# EAGLE design mainboard (EAGLE 7.6.0)

## Sheet 1 of 2
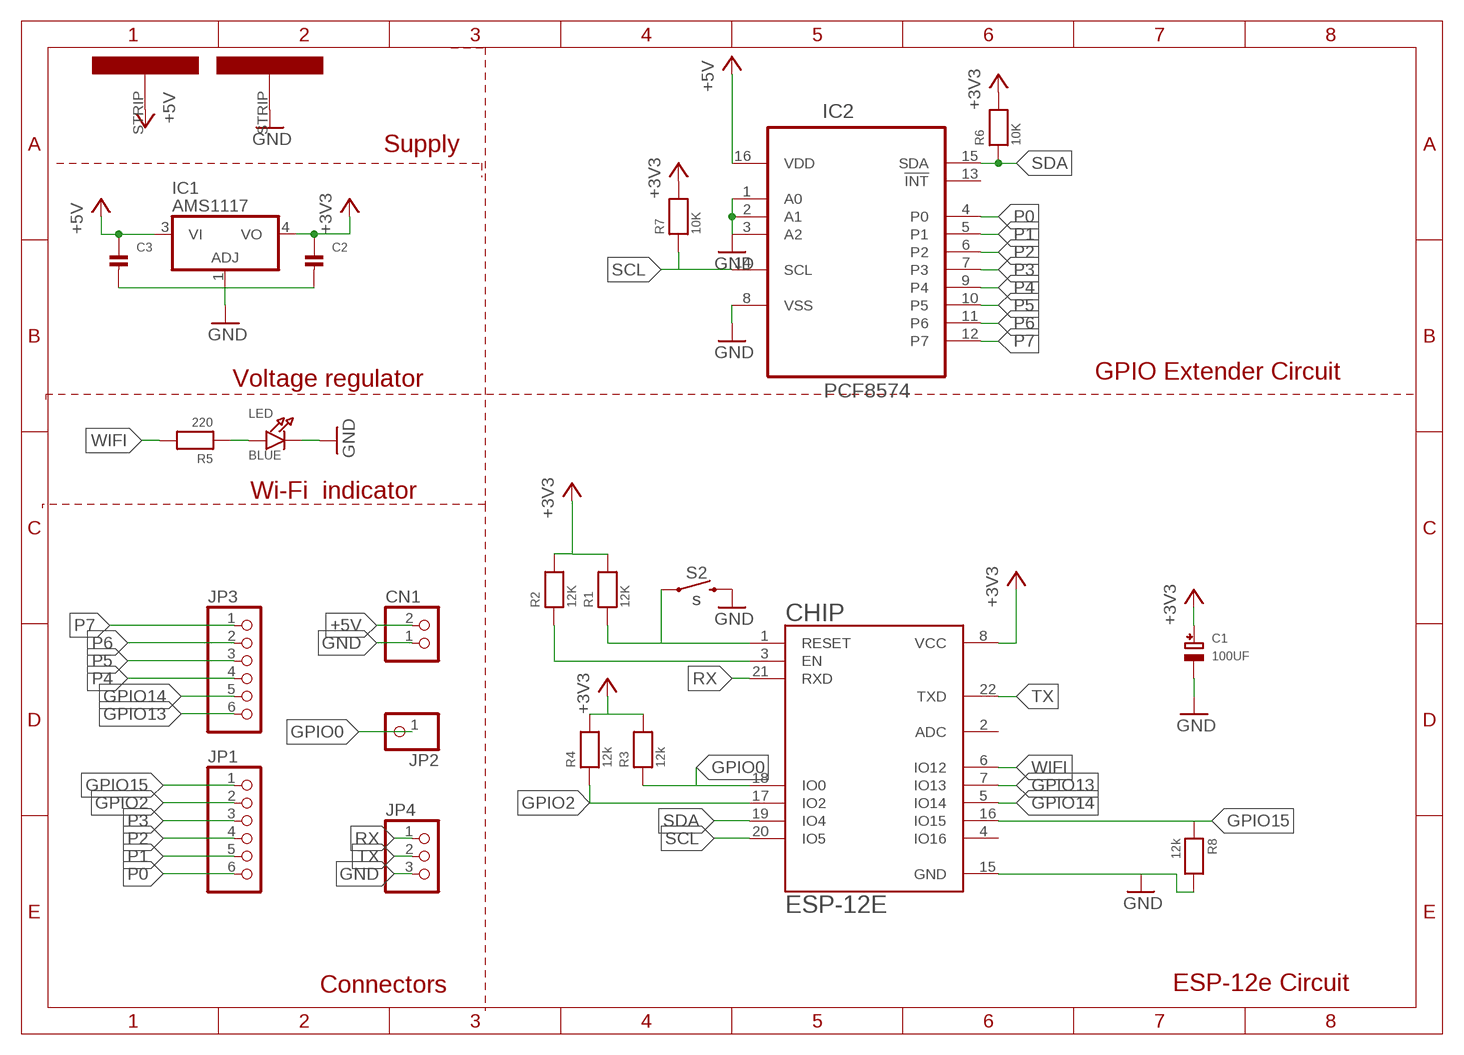
[diagram p0: schematic, sheet 1]

### Parts
C1  100UF  CAP_TANTALUMC/6032_WAVE  [EIA6032-28/C-W]
C2  CAP_CERAMIC0805  [0805]
C3  CAP_CERAMIC0805  [0805]
CHIP  ESP-12E  ESP8266-12E/ESP-12E  [XCVR_ESP8266-12E/ESP-12E]
CN1  JST_2PIN-THM  [JST-PH-2-THM]
IC1  AMS1117  317EMP  [SOT223]
IC2  PCF8574  PCF8574AT/3,518  [SOIC127P1032X265-16N]
JP1  PINHD-1X6CB  [1X06-CLEANBIG]
JP2  PINHD-1X1CB  [1X01-CLEANBIG]
JP3  PINHD-1X6CB  [1X06-CLEANBIG]
JP4  PINHD-1X3CB  [1X03-CLEANBIG]
LED  BLUE  LED0805  [CHIPLED_0805]
R1  12K  RESISTOR0805  [0805]
R2  12K  RESISTOR0805  [0805]
R3  12k  RESISTOR0805  [0805]
R4  12k  RESISTOR0805  [0805]
R5  220  RESISTOR0805  [0805]
R6  10K  RESISTOR0805  [0805]
R7  10K  RESISTOR0805  [0805]
R8  12k  RESISTOR0805  [0805]
RAIL1  RAIL1  STRIP  [STRIP]
RAIL2  RAIL2  STRIP  [STRIP]
S2  s  MOMENTARY-SWITCH-SPST-PTH-6.0MM-KIT  [TACTILE_SWITCH_PTH_6.0MM_KIT]

### Nets
+3V3: C1.+ C2.1 CHIP.8(VCC) IC1.4(VO) R1.2 R2.2 R3.2 R4.2 R6.2 R7.2
+5V: C3.1 CN1.2 IC1.3(VI) IC2.16(VDD) RAIL1.STRIP
GND: C1.- C2.2 C3.2 CHIP.15(GND) CN1.1 IC1.1(ADJ) IC2.1(A0) IC2.2(A1) IC2.3(A2) IC2.8(VSS) JP4.3 LED.C R8.2 RAIL2.STRIP S2.3
GPIO0: CHIP.18(IO0) JP2.1 R3.1
GPIO2: CHIP.17(IO2) JP1.2 R4.1
GPIO13: CHIP.7(IO13) JP3.6
GPIO14: CHIP.5(IO14) JP3.5
GPIO15: CHIP.16(IO15) JP1.1 R8.1
N$3: CHIP.1(RESET) R1.1 S2.1
N$4: CHIP.3(EN) R2.1
N$5: LED.A R5.1
P0: IC2.4(P0) JP1.6
P1: IC2.5(P1) JP1.5
P2: IC2.6(P2) JP1.4
P3: IC2.7(P3) JP1.3
P4: IC2.9(P4) JP3.4
P5: IC2.10(P5) JP3.3
P6: IC2.11(P6) JP3.2
P7: IC2.12(P7) JP3.1
RX: CHIP.21(RXD) JP4.1
SCL: CHIP.20(IO5) IC2.14(SCL) R7.1
SDA: CHIP.19(IO4) IC2.15(SDA) R6.1
TX: CHIP.22(TXD) JP4.2
WIFI: CHIP.6(IO12) R5.2
Unconnected: CHIP.2(ADC) CHIP.4(IO16) IC2.13(!INT)

### Notes on the sheet
- Supply
- Voltage regulator | GPIO Extender Circuit
- Wi-Fi  indicator
- Connectors | ESP-12e Circuit

## Sheet 2 of 2
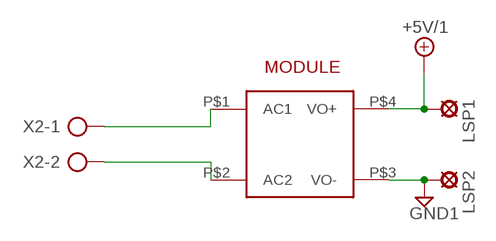
[diagram p1: schematic, sheet 2]

### Parts
LSP1  LSP10  [LSP10]
LSP2  LSP10  [LSP10]
MODULE  HLK-PM01  [HLK-PM01]
X2  AK500/2-H  [AK500/2-H]

### Nets
+5V/1: LSP1.MP MODULE.P$4(VO+)
GND1: LSP2.MP MODULE.P$3(VO-)
N$6: MODULE.P$1(AC1) X2.1
N$7: MODULE.P$2(AC2) X2.2

## Library data of the parts
C1 = microbuilder:CAP_TANTALUM: Tantalum Capacitors Wave footprints have larger pads and are meant to be used for hand soldering. Reflow footprints are optimised for solder paste and a reflow oven. EIA3216-18/A-[R/W] - Size A / 3216-18 / 1206 footprint 4.7µF 25V 10% Tantalum Capacitor 10µF 16V 10% Tantalum Capacitor [Digikey: 495-2236-2-ND] EIA3528-21/B-[R/W] - Size B / 3528-21 47µF 10V 10% Tantalum Capactior [Digikey: 495-2216-1-ND] EIA6032-28/C-[R/W] - Size C / 6032-28 10µF 35V 20% Tantalum Capacitor [Digikey: 495-2285-1-ND] 100µF 16V 10% Tantalum Capactior [Digikey: 399-5214-1-ND]
C2 C3 = microbuilder:CAP_CERAMIC: Ceramic Capacitors 0402 - 0402 Surface Mount Capacitors 16pF 50V 5% [Digikey: 445-4899-2-ND] 18pF 50V 5% [Digikey: 490-1281-2-ND] 22pF 50V 5% [Digikey: 490-1283-2-ND] 68pF 50V 5% [Digikey: 490-1289-2-ND] 0.1uF 10V 10% [Digikey: 490-1318-2-ND] 1.0uF 6.3V 10% [Digikey: 490-1320-2-ND] 0603 - 0603 Surface Mount Capacitors 16 pF 50V 5% [Digikey: 445-5051-2-ND] 22 pF 50V [Digikey: PCC220ACVTR-ND] 33 pF 50V 5% [Digikey: 490-1415-1-ND] 56pF 50V 5% [Digikey: 490-1421-1-ND] 220pF 50V 5% [Digikey: 445-1285-1-ND] 680 pF 50V 2200 pF 50V 5% C0G [Digikey: 445-1297-1-ND] 5600 pF 100V 5% X7R [Digikey: 478-3711-1-ND] 0.1 µF 25V 10% [Digikey: PCC2277TR-ND] 0.22 µF 16V 10% X7R [Digikey: 445-1318-1-ND] 1.0 µF 25V 10% [Digikey: 445-5146-2-ND] 0603 - RF Specific 3pF 250V +/-0.1pF RF [Digikey: 712-1347-1-ND] 18 pF 250V 5% [Digikey: 478-3505-1-ND or 712-1322-1-ND] 56 pF 250V 5% C0G RF [Digikey: 490-4867-1-ND] 68 pF 250V RF [Digikey: 490-4868-1-ND] 0805 - 0805 Surface Mount Capacitors 220 pF 250V 2% RF Ceramic Capacitor [Digikey: 712-1398-1-ND] 1000 pF 50V 2% NP0 Ceramic Capacitor [Digikey: 478-3760-1-ND] 0.1 µF 25V 10% Ceramic Capacitor [Digikey: PCC1828TR-ND] 1.0 µF 16V 10% Ceramic Capacitor[Digikey: 490-1691-2-ND] 10.0 µF 10V 10% Ceramic Capacitor[Digikey: 709-1228-1-ND] 10.0 uF 16V 10% Ceramic Capacitor [Digikey: 478-5165-2-ND] 47 uF 6.3V 20% Ceramic Capacitor [Digikey: 587-1779-1-ND or 399-5506-1-ND] 1206 - 1206 Surface Mount Capacitors 47uF 10V 20% Ceramic Capacitor [Digikey: 490-5528-1-ND or 399-5508-1-ND or 445-6010-1-ND] 100uF 6.3V -20%, +80% Y5V Ceramic Capacitor (Digikey: 490-4512-1-ND, Mouser: 81-GRM31CF50J107ZE1L)
CHIP = ESP8266-12E_ESP-12E:ESP8266-12E/ESP-12E: ESP-12E WiFi Module; AVAILABILITY: Unavailable; DESCRIPTION: This WiFi module has a 32-bit MCU micro and clock speeds supporting 80 MHz or 160 MHz. Supports the RTOS and integrated Wi-Fi MAC/BB/RF/PA/LNA, and has an on-board antenna.; MF: AI-Thinker; MP: ESP8266-12E/ESP-12E; PACKAGE: None; PRICE: None
CN1 = adafruit:JST_2PIN: JST 2-Pin Connectors of various flavors SMT-RA (S2B-PH-SM4) 4UConnector #17311 SMT (B2B-PH-SM4) THM-RA (S2B-PH) THM (B2B-PH)
IC1 = linear:*317: Positive VOLTAGE REGULATOR
IC2 = PCF8574AT_3_518:PCF8574AT/3,518: IC, I/O EXPANDER, 8BIT, 16SOIC; DESCRIPTION: PCF8574 Series 2.5 - 6 V Remote 8-bit I/O Expander for I2C-bus - SOIC-16; DIGI-KEY_PART_NUMBER: 568-1074-1-ND; DIGI-KEY_PURCHASE_URL: https://www.digikey.com/product-detail/en/nxp-usa-inc/PCF8574AT-3,518/568-1074-1-ND/735790?utm_source=snapeda&utm_medium=aggregator&utm_campaign=symbol; MF: NXP USA; MP: PCF8574AT/3,518; PACKAGE: SOIC-16 NXP Semiconductors
JP1 JP3 = adafruit:PINHD-1X6: PIN HEADER
JP2 = adafruit:PINHD-1X1: Pin header 1x1 for 0.1" spacing With round pins
JP4 = adafruit:PINHD-1X3: PIN HEADER
LED = microbuilder:LED: LED 0603 - 0603 Surface Mount Package 2mA: Green LED - Low Power (3.9mcd, 2ma, 1.7Vf) - Digikey: 475-2709-2-ND Orange LED - Low Power (9.8mcd, 2ma, 1.8Vf) - Digikey: 475-1194-2-ND Red LED - Low Power (5mcd, 2ma, 1.8Vf) - Digikey: 475-1195-2-ND Yellow LED - Low Power (7mcd, 2ma, 1.8Vf) - Digikey: 475-1196-2-ND 5mA: Blue LED - Low Power (17mcd, 5ma, 2.9Vf) - Digikey: LNJ937W8CRACT-ND 0805 - 0805 Surface Mount Package 2mA: Red LED (8.8mcd, 2mA, 1.8Vf, Clear) - Low Power [Digikey: 475-2510-1-ND] Green LED (5mcd, 2mA, 1.8Vf, Clear) - Low Power [Digikey: 475-2730-1-ND] Yellow LED (11.3mcd, 2mA, 1.8Vf, Clear) - Low Power [Digikey: 475-2555-1-ND] 20mA: Red LED (104mcd, 20mA, Diffused) - LS R976 [Digikey: 475-1278-6-ND] Red LED (12mcd, 20mA, 2.0Vf, Clear) - APT2012EC [Digikey: 754-1128-1-ND] Green LED (15mcd, 20mA, 2.2Vf, Clear) - APT2012GC [Digikey: 754-1131-1-ND] Orange LED (160mcd, 20mA, 2.1Vf, Clear) - APT2012SECK [Digikey: 754-1130-1-ND] 1206 - 1206 Surface Mount Package Green LED (26mcd, 20mA, Diffused) - LG N971 [Digikey: 475-1407-6-ND] Red LED (15mcd, 20mA, Diffused) - LH N974 [Digikey: 475-1416-6-ND]
LSP1 LSP2 = solpad:LSP10: SOLDER PAD drill 1.0 mm, distributor Buerklin, 12H555
MODULE = HLK-PM01:HLK-PM01: HI-LINK Ultra-compact power module HLK-PM01 Meet UL, CE requirements Ultra-thin, ultra-small All voltage input (AC: 90 ~ 264V) Low ripple and low noise Output overload and short circuit protection High efficiency, high power density The product is designed to meet the requirements of EMC and Safety Test Low power consumption, environmental protection, no-load loss <0.1W 100% load aging and testing; AVAILABILITY: Unavailable; MF: Hi-link; MP: hlk-pm01; PACKAGE: Package Analog Devices; PRICE: None
R1-R8 = microbuilder:RESISTOR: Resistors 0402 - 0402 Surface Mount Package 22 Ohm 1% 1/16W [Digikey: 311-22.0LRTR-ND] 33 Ohm 5% 1/16W 1.0K 5% 1/16W 1.5K 5% 1/16W 2.0K 1% 1/16W 10.0K 1% 1/16W [Digikey: 311-10.0KLRTR-ND] 10.0K 5% 1/16W [Digikey: RMCF0402JT10K0TR-ND] 12.1K 1% 1/16W [Digikey: 311-22.0LRTR-ND] 100.0K 5% 1/16W 0603 - 0603 Surface Mount Package 0 Ohm 1/10 Watt 1% Resistor 15 Ohm 1/10 Watt 1% Resistor 33 Ohm 1/10 Watt 1% Resistor 49.9 Ohm 1/10 Watt 1% Resistor 100 Ohm 1/10 Watt 1% Resistor 150 Ohm 1/10 Watt 1% Resistor 240 Ohm 1/10 Watt 1% Resistor 390 Ohm 1/10 Watt 1% Resistor 560 Ohm 1/10 Watt 1% Resistor 680 Ohm 1/10 Watt 1% Resistor 750 Ohm 1/10 Watt 1% Resistor 1.0K Ohm 1/10 Watt 1% Resistor 1.5K Ohm 1/10 Watt 1% Resistor 2.0K Ohm 1/10 Watt 1% Resistor 2.2K Ohm 1/10 Watt 1% Resistor 3.3K Ohm 1/10 Watt 1% Resistor 4.7K Ohm 1/10 Watt 1% Resistor 10.0K Ohm 1/10 Watt 1% Resistor 12.0K Ohm 1/10 Watt 1% Resistor 12.1K Ohm 1/10 Watt 1% Resistor 20.0K Ohm 1/10 Watt 1% Resistor 33.0K Ohm 1/10 Watt 1% Resistor 100.0K Ohm 1/10 Watt 1% Resistor 0805 - 0805 Surface Mount Package 0 Ohm 1/8 Watt 1% Resistor 33 Ohm 1/8 Watt 1% Resistor 100 Ohm 1/8 Watt 1% Resistor 150 Ohm 1/8 Watt 1% Resistor 200 Ohm 1/8 Watt 1% Resistor 240 Ohm 1/8 Watt 1% Resistor 330 Ohm 1/8 Watt 1% Resistor 390 Ohm 1/8 Watt 1% Resistor 470 Ohm 1/8 Watt 1% Resistor 1.0K Ohm 1/8 Watt 1% Resistor 1.5K Ohm 1/8 Watt 1% Resistor 2.0K Ohm 1/8 Watt 1% Resistor 4.7K Ohm 1/8 Watt 1% Resistor 5.1K Ohm 1/8 Watt 1% Resistor 5.6K Ohm 1/8 Watt 1% Resistor 10.0K Ohm 1/8 Watt 1% Resistor 22.0K Ohm 1/8 Watt 1% Resistor 33.0K Ohm 1/8 Watt 1% Resistor 100K Ohm 1/8 Watt 1% Resistor 1206 - 1206 Surface Mount Package 2012 - 2010 Surface Mount Package 0.11 Ohm 1/2 Watt 1% Resistor - Digikey: RHM.11UCT-ND
RAIL1 RAIL2 = Alfred:STRIP
S2 = SparkFun-Switches:MOMENTARY-SWITCH-SPST: Momentary Switch (Pushbutton) - SPST Normally-open (NO) SPST momentary switches (buttons, pushbuttons). Variants PTH-12MM - 12mm square, through-hole Momentary Pushbutton Switch - 12mm Square <https://www.sparkfun.com/products/9190> (COM-09190) PTH-6.0MM, PTH-6.0MM-KIT - 6.0mm square, through-hole Mini Pushbutton Switch <https://www.sparkfun.com/products/97> (COM-00097) KIT package intended for soldering kit's - only one side of pads' copper is exposed. PTH-RIGHT-ANGLE-KIT - Right-angle, through-hole Right Angle Tactile Button <https://www.sparkfun.com/products/10791> - Used on SparkFun BigTime Watch Kit <https://www.sparkfun.com/products/11734> SMD-12MM - 12mm square, surface-mount Tactile Button - SMD (12mm) <https://www.sparkfun.com/products/12993> (COM-12993) Used on SparkFun PicoBoard <https://www.sparkfun.com/products/11888> SMD-4.5MM - 4.5mm Square Trackball Switch Used on SparkFun Blackberry Trackballer Breakout <https://www.sparkfun.com/products/13169> SMD-4.6MMX2.8MM - 4.60mm x 2.80mm, surface mount Used on SparkFun SAMD21 Mini Breakout <https://www.sparkfun.com/products/13664> SMD-5.2MM, SMD-5.2-REDUNDANT - 5.2mm square, surface-mount Mini Pushbutton Switch - SMD <https://www.sparkfun.com/products/8720> (COM-08720) Used on Arduino Pro Mini <https://www.sparkfun.com/products/11114> REDUNDANT package connects both switch circuits together SMD-6.0X3.5MM - 6.0 x 3.5mm, surface mount Momentary Reset Switch SMD <https://www.sparkfun.com/products/8229> (COM-08229) SMD-6.2MM-TALL - 6.2mm square, surface mount Tactile Button - SMD (6mm) <https://www.sparkfun.com/products/12992> Used on SparkFun Digital Sandbox <https://www.sparkfun.com/products/12651> SMD-RIGHT-ANGLE - Right-angle, surface mount Used on SparkFun Block for Intel® Edison - Arduino <https://www.sparkfun.com/products/13036>; PROD_ID: SWCH-08441; SF_SKU: COM-00097
X2 = con-ptr500:AK500/2-H: CONNECTOR Aug. 2004 / PTR Meßtechnik: Die Bezeichnung der Serie AK505 wurde geändert. Es handelt sich hierbei um AK500 in horizontaler Ausführung.; OC_FARNELL: unknown; OC_NEWARK: unknown

## Net classes
0 default: width 0.4 mm, drill 0.5 mm, clearance 0.305 mm

## Board
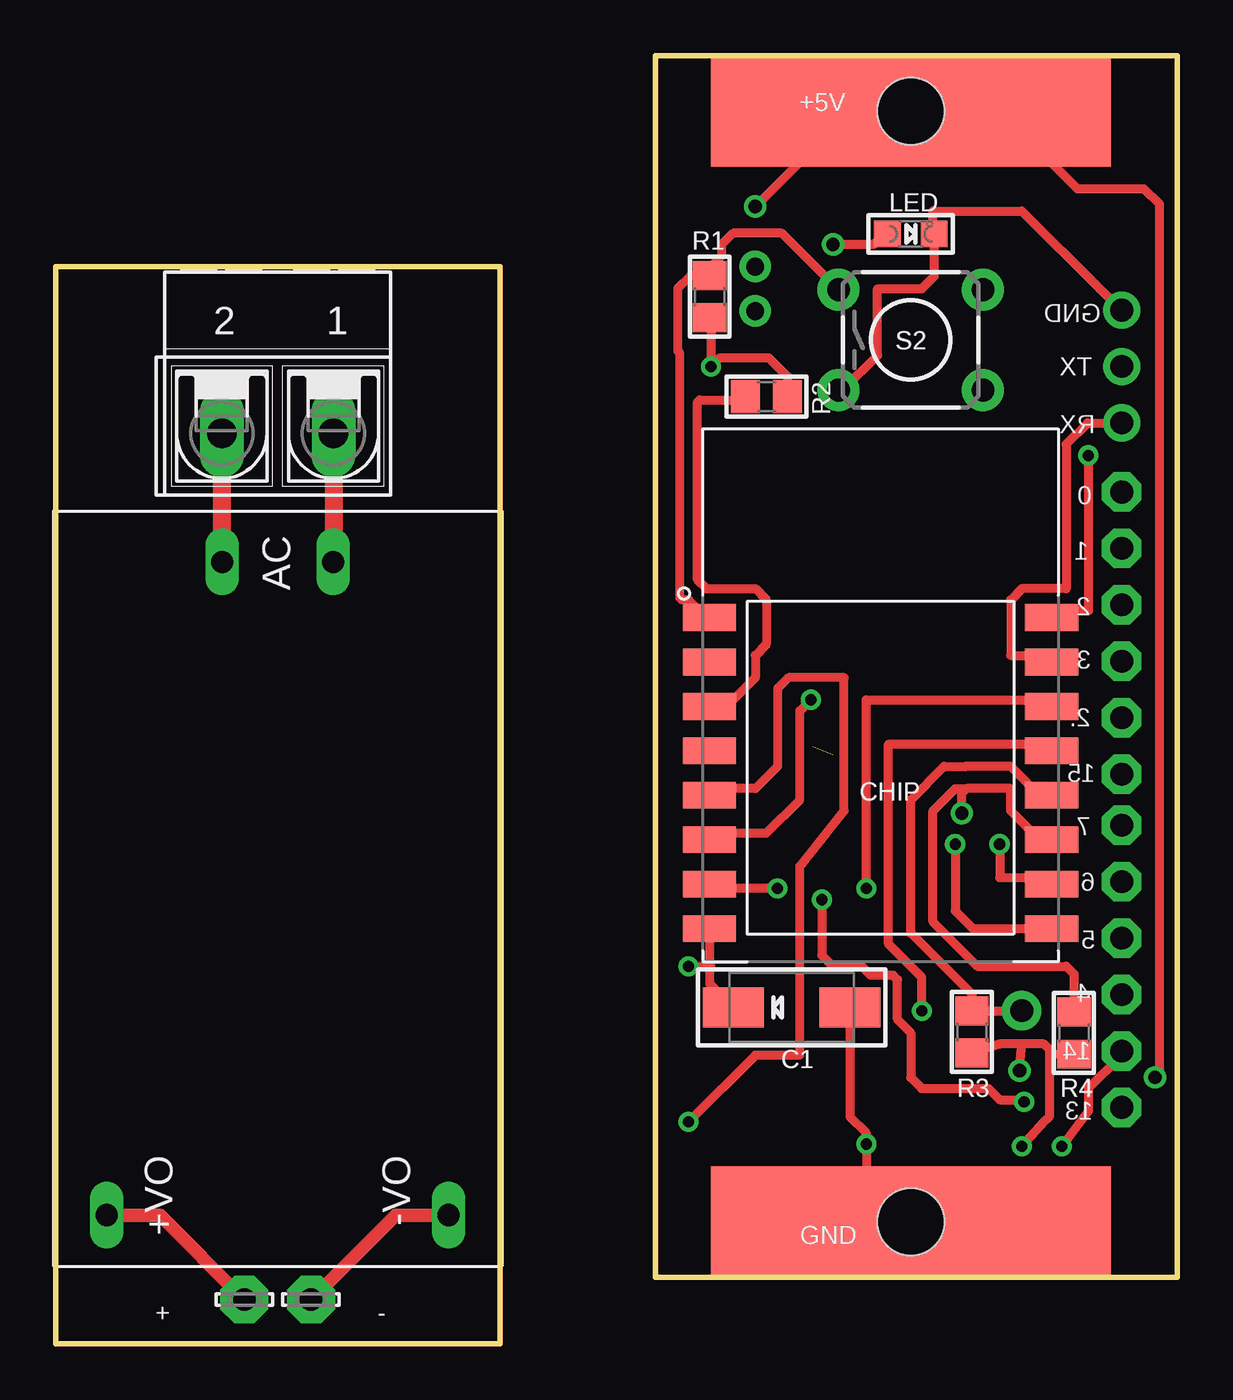
[diagram p2: board, top side]
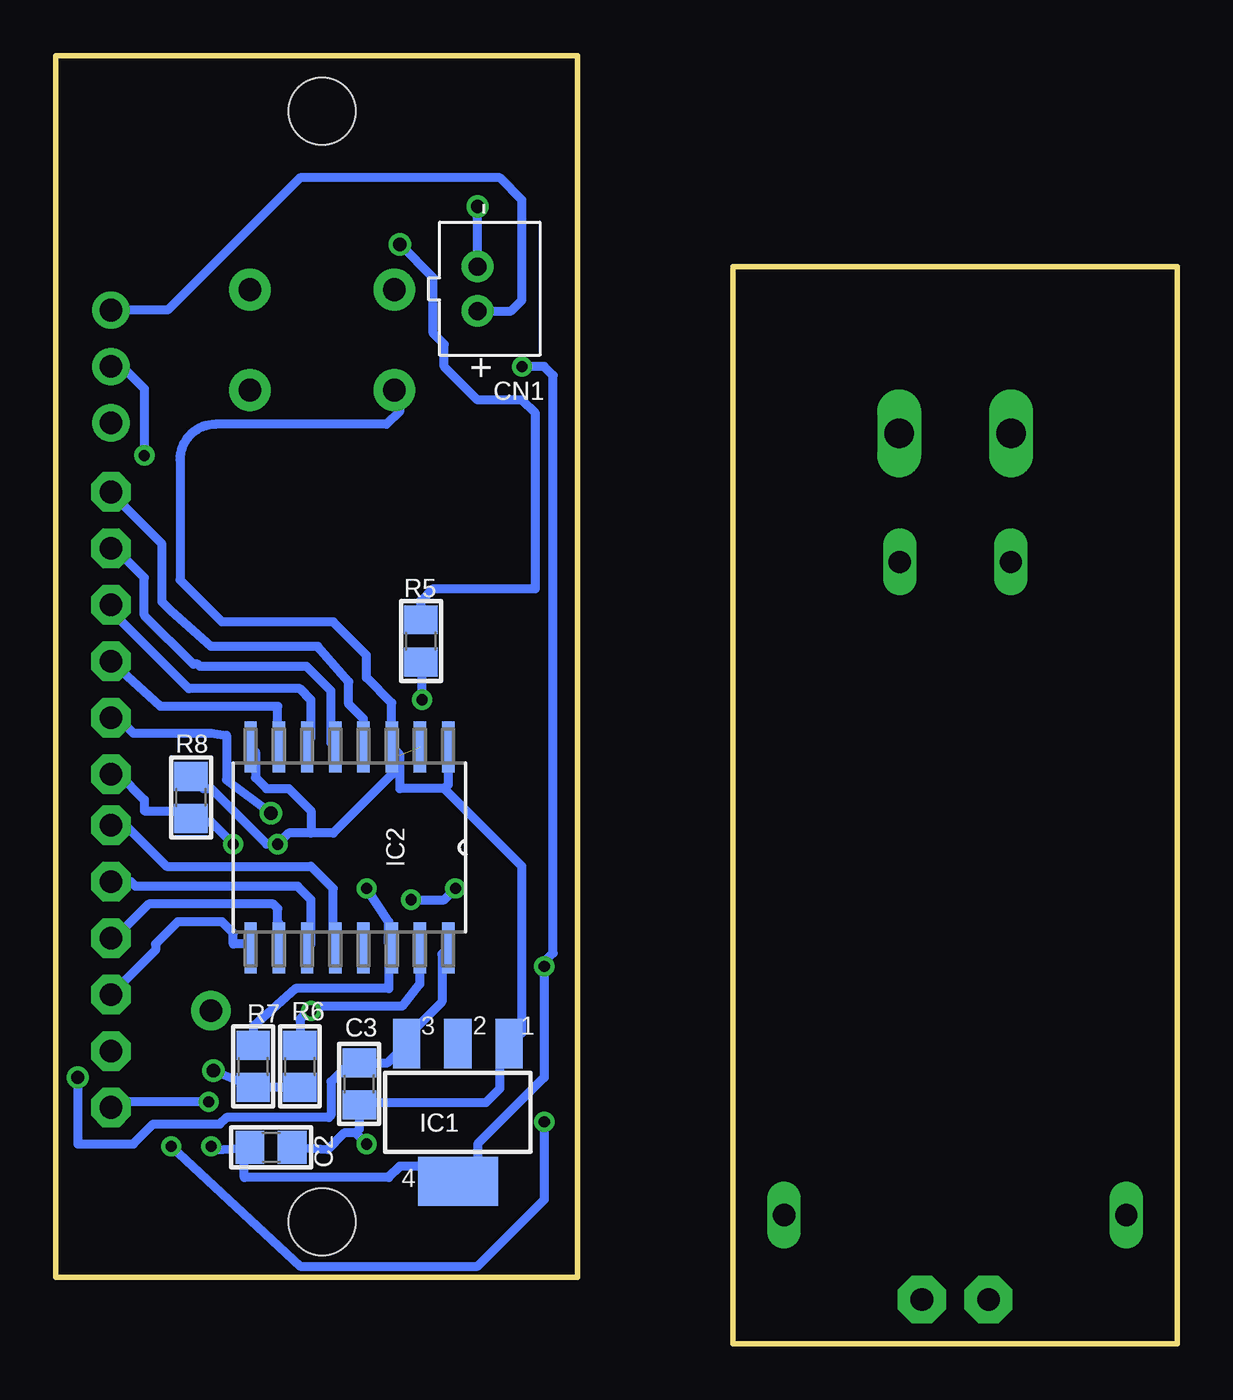
[diagram p3: board, bottom side, seen from below]

Size 50.5 x 58 mm. Coordinates in mm from the lower left corner, seen from the top.
Outline: 27,3 50.5,3 50.5,58 27,58 27,3
Outline: 0,48.5 0,0 20,0 20,48.5 0,48.5
Copper layers (1*16): Top 0.035mm / dielectric 0.5mm / Bottom 0.035mm
Design rules "default *": minimum track width 15mil, minimum drill 10mil, track to track 12mil, track to pad 12mil, pad to pad 12mil, via to via 12mil, smd to smd 12mil, copper to edge 0.3mm, drill to drill 8mil, minimum pad ring 10mil, minimum via ring 8mil, stop-mask expansion 4mil, vias tented up to drill 0.7mm, thermal gap 10mil

### Footprints (pad centres in the part's own frame; a part is rotated, then mirrored left to right if it is on the bottom)
EIA6032-28/C-W = smd 2.75 x 1.8: + 2.625,0; - -2.625,0
0805 = smd 1.3 x 1.5: 1 -0.95,0; 2 0.95,0
XCVR_ESP8266-12E/ESP-12E = smd 2.4 x 1.2: 1 -7.7,7; 2 -7.7,5; 3 -7.7,3; 4 -7.7,1; 5 -7.7,-1; 6 -7.7,-3; 7 -7.7,-5; 8 -7.7,-7; 15 7.7,-7; 16 7.7,-5; 17 7.7,-3; 18 7.7,-1; 19 7.7,1; 20 7.7,3; 21 7.7,5; 22 7.7,7
JST-PH-2-THM = drill 0.8 pad 1.422: 1 1,0; 2 -1,0
SOT223 = smd 1.219 x 2.235: 1 -2.311,-3.099; 2 0,-3.099; 3 2.311,-3.099 | smd 3.6 x 2.2: 4 0,3.099
SOIC127P1032X265-16N = smd 2.286 x 0.559: 1 -4.521,4.445; 2 -4.521,3.175; 3 -4.521,1.905; 4 -4.521,0.635; 5 -4.521,-0.635; 6 -4.521,-1.905; 7 -4.521,-3.175; 8 -4.521,-4.445; 9 4.521,-4.445; 10 4.521,-3.175; 11 4.521,-1.905; 12 4.521,-0.635; 13 4.521,0.635; 14 4.521,1.905; 15 4.521,3.175; 16 4.521,4.445
1X06-CLEANBIG = drill 1.016 pad 1.778 octagon: 1 -6.35,0; 2 -3.81,0; 3 -1.27,0; 4 1.27,0; 5 3.81,0; 6 6.35,0
1X01-CLEANBIG = drill 1.016 pad 1.778: 1 0,0
1X03-CLEANBIG = drill 1.016 pad 1.676: 1 -2.54,0; 2 0,0; 3 2.54,0
CHIPLED_0805 = smd 1.2 x 1.2: A 0,-1.05; C 0,1.05
LSP10 = drill 1.016 pad 2.159 octagon: MP 0,0
HLK-PM01 = drill 1 long: P$1 -14.7,2.5; P$2 -14.7,-2.5; P$3 14.7,7.7; P$4 14.7,-7.7
STRIP = smd 18 x 5: STRIP 0,0 | hole 3: 0,0
TACTILE_SWITCH_PTH_6.0MM_KIT = drill 1.016 pad 1.88: 1 -3.251,2.261; 2 3.251,2.261; 3 -3.251,-2.261; 4 3.251,-2.261
AK500/2-H = drill 1.321 long: 1 -2.515,0; 2 2.515,0

### Placement (x,y rotation side)
C1  33.14,15.15 180 top
C2  40.8,8.85 0 bottom
C3  36.83,11.71 270 bottom
CHIP  37.14,25.7 0 top
CN1  31.5,47.5 270 bottom
IC1  32.39,10.42 180 bottom
IC2  37.27,22.35 270 bottom
JP1  48,32 90 top
JP2  43.5,15 0 top
JP3  48,17 270 top
JP4  48,44 90 top
LED  38.5,49.97 270 top
LSP1  8.5,2 0 top
LSP2  11.5,2 0 top
MODULE  10,20.5 270 top
R1  29.45,47.15 270 top
R2  32,42.65 0 top
R3  41.25,14.05 270 top
R4  45.85,14 270 top
R5  34.05,31.65 270 bottom
R6  39.5,12.5 270 bottom
R7  41.6,12.5 270 bottom
R8  44.4,24.6 90 bottom
RAIL1  38.5,55.5 0 top
RAIL2  38.5,5.5 0 top
S2  38.5,45.2 0 top
X2  10,41 180 top

### Tracks (layer width: path | path; a pad name or v marks a point on that pad's centre or on a via)
+3V3  (via drill 0.5, 0.6)
  Top 0.4: 44.5,13.5 43.5,13.5 42.5,13.5 R3.2 | 44.5,10 v43.5,8.9 | v28.5,17 29.44,17 29.5,17
  Top 0.406: CHIP.8 29.44,17 29.44,16.23 C1.+ | 44.5,13.5 44.75,13.25 | 44.75,13.25 44.95,13.05 R4.2 | 44.5,10 44.75,10.25 44.75,13.25 | 29.45,44.05 v29.5,44 | v29.5,44 29.9,44.4 32.1,44.4 32.95,43.55 R2.2 | R1.2 29.5,46.15 v29.5,44 | v43.4,12.3 43.5,13.5
  Bottom 0.4: 32,7.5 IC1.4
  Bottom 0.406: IC1.4 33.07,8 35,8 35.5,7.5 42,7.5 42,8.5 C2.1 43.25,8.75 v43.5,8.9 | 32.39,7.71 IC1.4 | v29.5,44 28.5,44 28.1,43.6 28.1,17.6 28.5,17.2 v28.5,17 28.5,12 31.5,9 31.5,8.21 IC1.4 | R6.2 R7.2 v43.4,12.3
+5V  (via drill 0.6)
  Top 0.406: RAIL1.STRIP 42.5,55.5 46,52 49,52 49.7,51.3 49.7,12.2 v49.5,12 | 31.5,53.5 31,54 37,54 RAIL1.STRIP | v31.5,51.2 35.8,55.5 RAIL1.STRIP
  Bottom 0.406: IC2.16 33.1,17.55 33.1,15.4 34.7,13.8 IC1.3 35.56,12.66 C3.1 37.24,12.66 38.1,11.8 38.1,10.3 38.2,10.2 42.8,10.2 43.1,9.9 46.1,9.9 47,9 49.5,9 v49.5,12 | CN1.2 v31.5,51.2
+5V/1
  Top 0.61: MODULE.P$4 4.7,5.8 LSP1.MP
GND  (via drill 0.5)  (1 unrouted)
  Top 0.4: 37,47.5 37,44.5 35.5,43 S2.3 | 47,47.5 43.5,51 39.5,51 39.5,50 LED.C | 44.5,19 CHIP.15
  Top 0.406: RAIL2.STRIP 36.5,7.5 v36.5,9 36.5,9.5 35.77,10.23 C1.- | v40.5,22.5 40.5,19.5 41.3,18.7 CHIP.15 | 47,47.5 47.96,46.54 JP4.3 | LED.C 39.55,48.05 39,47.5 37,47.5
  Bottom 0.4: 30.5,11.5 30.5,13.5 IC1.1 30,14 29.5,14 29.5,21.5 33,25
  Bottom 0.406: IC2.1 32.83,25.18 33,25 35,25 35,26.51 IC2.3 | IC2.3 35.37,25.64 38,23 39,23 | IC2.8 41.5,26.66 41.5,25.5 41,25 40,25 39,24 39,23 | R8.2 43.85,25 43.5,25 41,22.5 v40.5,22.5 40,23 39,23 | IC2.3 35.37,28.86 36.5,30 36.5,31 38,32.5 43,32.5 44.9,34.4 44.9,39.8 arc90 43.3,41.4 35.6,41.4 35,42 35,42.69 S2.3 | 30.5,11.5 31.14,10.86 36.73,10.86 C3.2 36.83,9.67 37,9.5 | 37,9.5 v36.5,9 | CN1.1 30,46.5 29.5,47 29.5,51.5 30.5,52.5 39.5,52.5 45.46,46.54 JP4.3 | C2.2 38.25,8.75 37.5,9.5 37,9.5
GND1
  Top 0.61: MODULE.P$3 15.3,5.8 LSP2.MP
GPIO0
  Top 0.4: 41,26 43,26 44.5,24.5 CHIP.18 | 42,15 R3.1
  Top 0.406: 41,26 40,26 38.5,24.5 38.5,18.5 41.25,15.75 R3.1 | 42,15 JP2.1
GPIO2  (via drill 0.6)
  Top 0.4: 41,25 43,25 43,24 44.5,22.5 CHIP.17
  Top 0.406: v40.8,23.9 40.8,24.8 41,25 40.5,25 39.5,24 39.5,19 41.5,17 45.5,17 45.85,16.65 R4.1
  Bottom 0.406: JP1.2 47.69,28.19 47,27.5 43.5,27.5 42.8,27.4 42.8,25.4 v40.8,23.9
GPIO13  (via drill 0.5)
  Top 0.4: v32.5,20.5 29.5,20.5 CHIP.7
  Top 0.406: v34.5,20 34.5,17.5 35,17 36.3,17 36.7,16.6 37.7,16.6 37.9,16.4 37.9,14.6 38.5,14 38.5,12 39,11.5 42,11.5 42.5,11 43.5,11 v43.6,10.9
  Bottom 0.4: v32.5,20.5 33,20 v34.5,20 | 48,10.5 JP3.6
  Bottom 0.406: 48,10.5 47.9,10.4 | v43.6,10.9 47.75,10.9 JP3.6
GPIO14  (via drill 0.5)
  Top 0.4: 31.5,25 29.5,25 CHIP.5 | v45.3,8.9 46.5,10.5 46.5,11.5 48,13 JP3.5
  Top 0.406: 31.5,25 32.5,26 32.5,29.5 33,30 35.5,30 35.5,24 33.5,21.5 33.5,13 31.5,13 v28.5,10
  Bottom 0.4: 31.5,3.5 39.5,3.5 v45.3,8.9
  Bottom 0.406: v28.5,10 28.5,6.5 31.5,3.5
GPIO15  (via drill 0.5)
  Top 0.4: v42.5,22.5 42.5,21 44.5,21 CHIP.16
  Bottom 0.4: v42.5,22.5 43.5,23.5 44,23.5 R8.1
  Bottom 0.406: JP1.1 47.65,25.65 46.5,24.5 46.5,24 44.75,24 R8.1
N$3
  Top 0.4: 28.5,33.5 29,33 CHIP.1
  Top 0.406: 28.5,33.5 28.2,33.5 28.1,33.6 28.1,44.6 28,44.7 28,47.5 28.6,48.1 R1.1 29.45,48.45 30,49 30,49.5 30.5,50 32.71,50 S2.1
N$4
  Top 0.406: CHIP.3 30.2,28.7 31.5,30 31.5,31 32,31.5 32,33.5 31.5,34 29.3,34 28.9,34.4 28.9,42.4 29,42.5 30.9,42.5 arc90 R2.1
N$5  (via drill 0.6)
  Top 0.406: 36.8,49.5 36.93,49.59 | 36.93,49.59 LED.A | v35,49.5 36.84,49.5 36.93,49.59
  Bottom 0.406: R5.1 34.05,33.45 33.5,34 28.9,34 28.9,41.9 29.5,42.5 31.5,42.5 33,44 33,45 33.5,45.5 33.5,48 v35,49.5
N$6
  Top 0.813: X2.1 12.52,35.22 MODULE.P$1
N$7
  Top 0.813: X2.2 7.49,35.22 MODULE.P$2
P0
  Bottom 0.406: IC2.4 36.63,28.14 37.3,28.8 37.3,29.8 38.7,31.4 43.5,31.4 45.3,33 45.7,33.4 45.7,36 48,38.3 JP1.6
P1
  Bottom 0.406: IC2.5 38.1,27.07 38.1,29.4 39.2,30.5 44,30.5 44.1,30.6 44.3,30.6 46.5,32.8 46.5,34.5 47.81,35.81 JP1.5
P2
  Bottom 0.406: IC2.6 39.3,27 39,27.3 39,29 39.5,29.5 44.5,29.5 48,33 JP1.4
P3
  Bottom 0.406: IC2.7 40.5,26.93 40.5,28.7 45.77,28.7 JP1.3
P4
  Bottom 0.406: IC2.9 41.89,18 42.5,18 42.5,18.5 43,19 45,19 46,18 46,17.73 JP3.4
P5
  Bottom 0.406: IC2.10 40.45,18.95 40.5,19 40.5,19.6 40.7,19.8 46.3,19.8 47.83,18.27 JP3.3
P6
  Bottom 0.406: IC2.11 39,18 39,20 39.6,20.6 46.9,20.6 47.11,20.81 JP3.2
P7
  Bottom 0.406: IC2.12 38,17.92 38,20.5 39,21.5 45.5,21.5 47.35,23.35 JP3.1
RX
  Top 0.4: 45.5,40.5 45.5,34 43.5,34 43,33.5 43,31 44.5,31 CHIP.21
  Top 0.406: 45.5,40.5 46.46,41.46 JP4.1
SCL  (via drill 0.5)
  Top 0.4: v36.5,20.5 36.5,29 44.5,29 CHIP.20
  Bottom 0.4: v36.5,20.5 35.5,19 35.5,18 IC2.14
  Bottom 0.406: IC2.14 35.5,17.69 35.5,16 39.7,16 41.6,14.3 R7.1
SDA  (via drill 0.5)
  Top 0.4: 43,27 44.5,27 CHIP.19 | 37.5,18 39,16.5 v39,15
  Top 0.406: 37.5,18 37.5,27 43,27
  Bottom 0.4: v39,15 39.05,15.05
  Bottom 0.406: IC2.15 34.1,16.2 34.9,15.2 38.7,15.2 39.05,15.05 39.5,14.6 R6.1
TX  (via drill 0.5)
  Top 0.4: v46.5,40 46.5,33 45,33 CHIP.22
  Bottom 0.406: JP4.2 47.5,44 46.5,43 v46.5,40
WIFI  (via drill 0.5)
  Top 0.4: 30.5,23 29.5,23 CHIP.6
  Top 0.406: 30.5,23 32,23 33.5,24.5 33.5,28.5 v34,29
  Bottom 0.4: v34,29 34,30.5 R5.2

### Text on the board
tPlace: +5V | GND | TX | RX | 0 | 1 | 2 | 3 | 2. | 15 | 7 | 6 | 5 | 4 | 14 | 13 | GND | + | -
_tNames: LED | R1 | S2 | R2 | CHIP | C1 | R3 | R4
_bNames: CN1 | R5 | R8 | IC2 | R6 | C3 | R7 | IC1 | C2